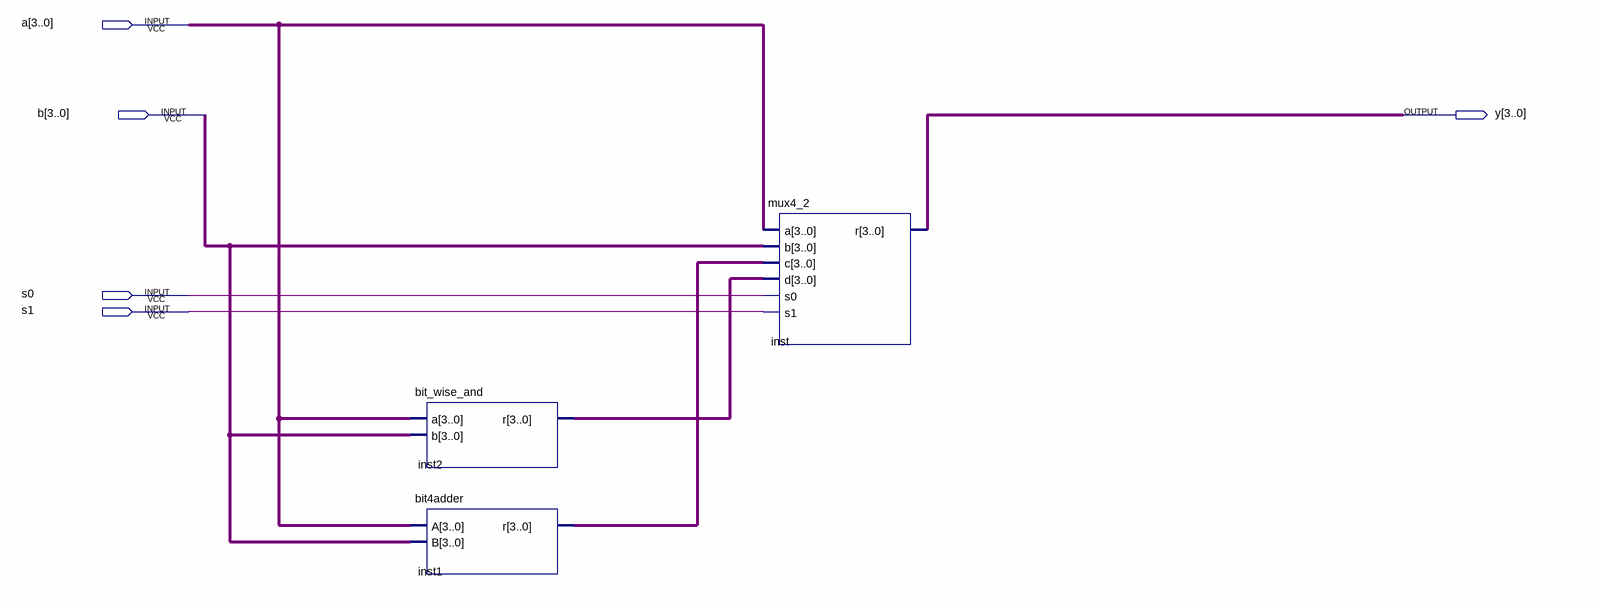
[diagram p0: schematic sheet]
// Quartus schematic ALU.bdf as structural Verilog: 3 symbols, 5 pins
module ALU (
  input  [3:0] a,
  input  [3:0] b,
  input  s0,
  input  s1,
  output [3:0] y
);

  wire [3:0] inst1_r, inst2_r;

  bit_wise_and inst2 (.a(a), .b(b), .r(inst2_r));
  bit4adder inst1 (.A(a), .B(b), .r(inst1_r));
  mux4_2 inst (.a(a), .b(b), .c(inst1_r), .d(inst2_r), .s0(s0), .s1(s1), .r(y));
endmodule
